# EAGLE design 40106PolyClock (EAGLE 8.7.0)
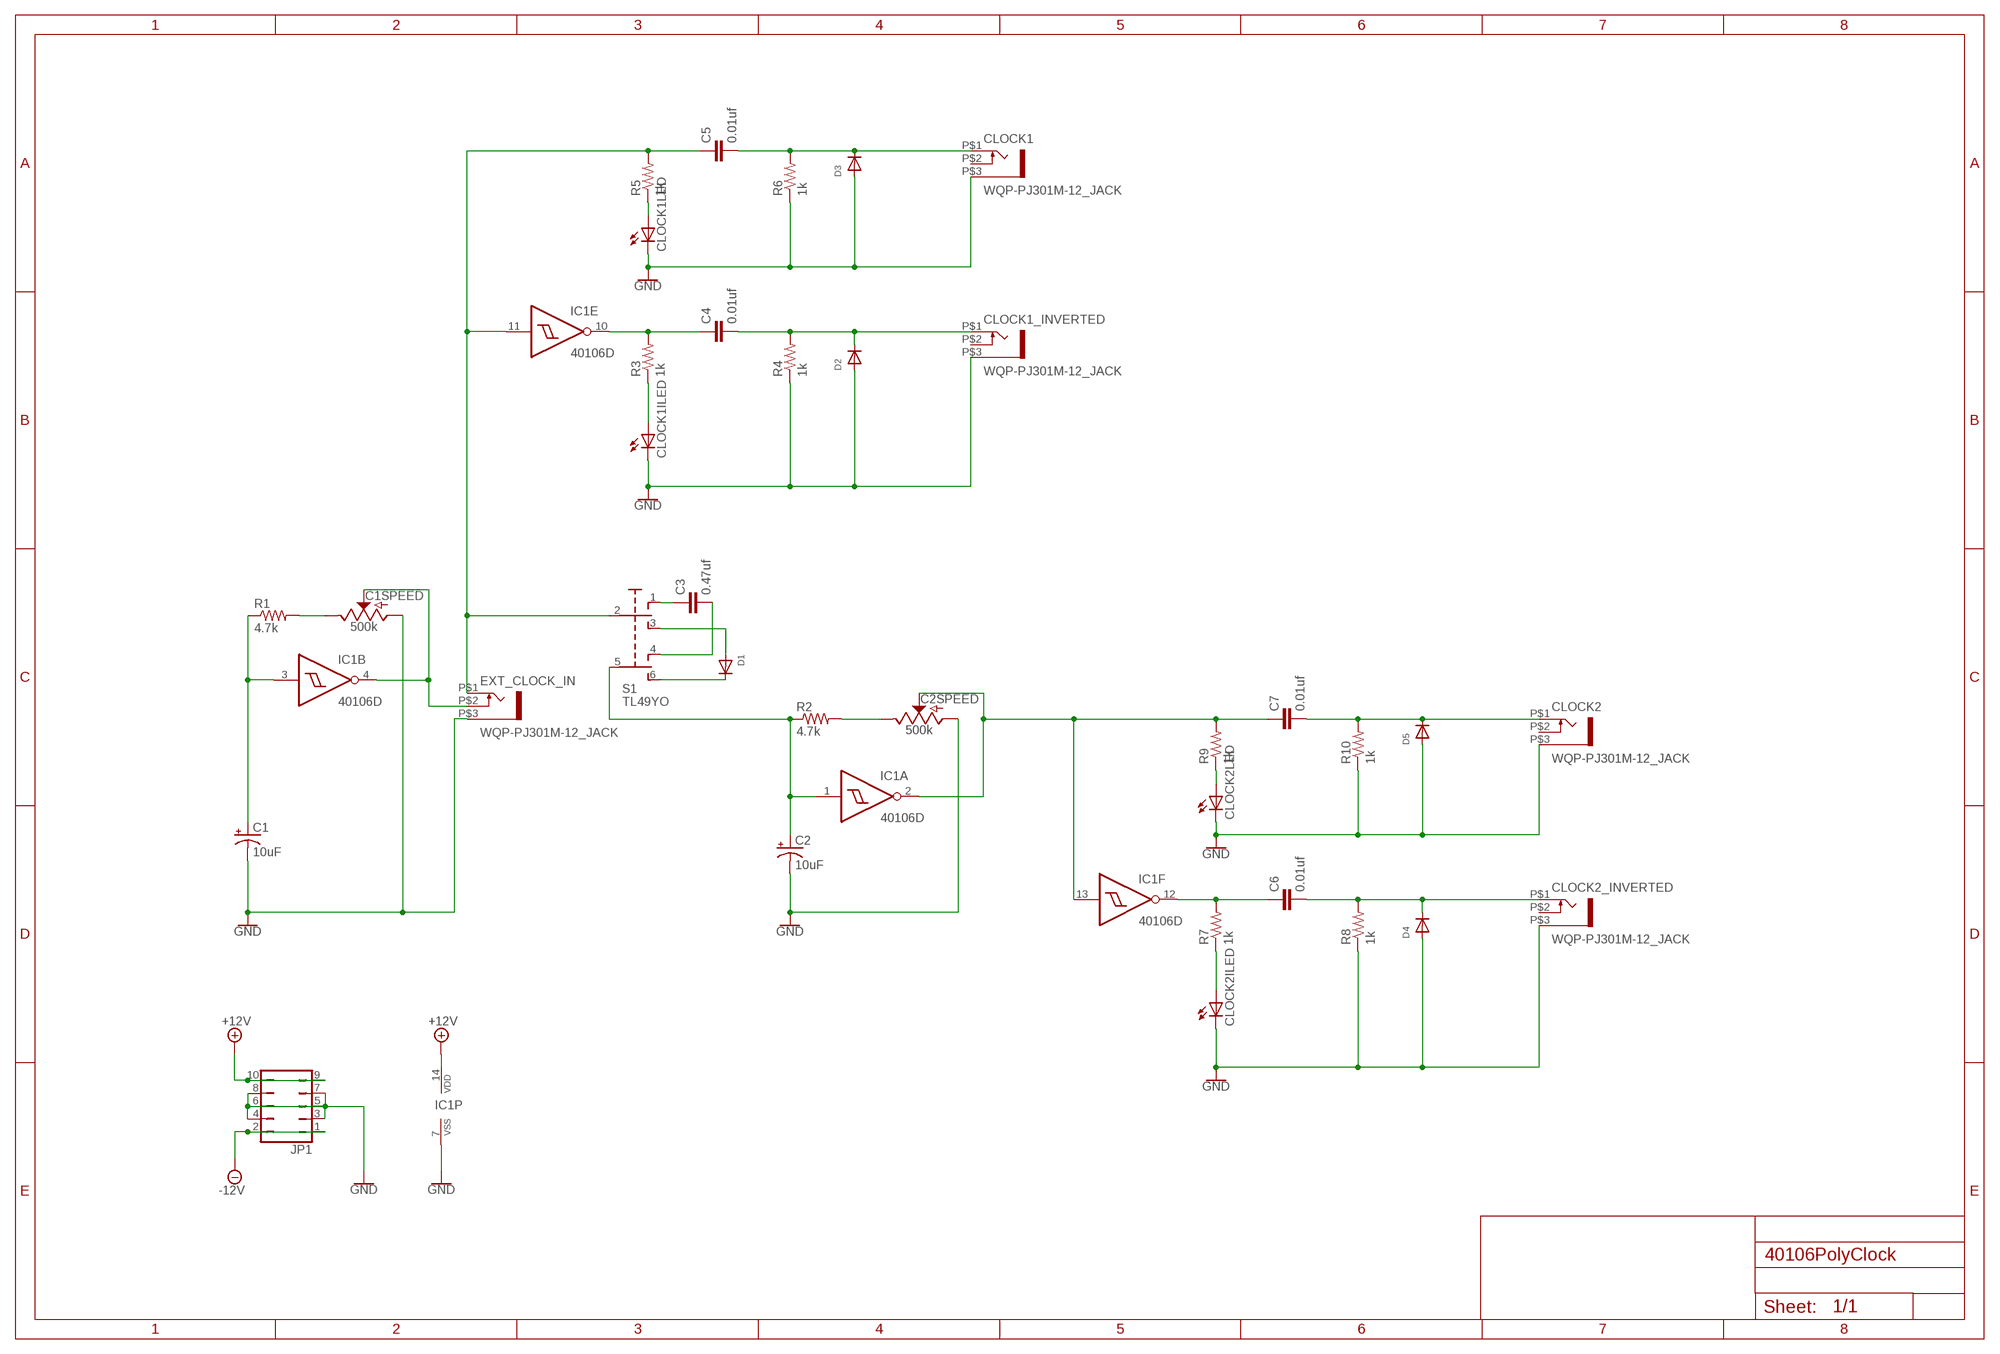
[diagram p0: schematic, sheet 1]

## Parts
C1  10uF  10UF-POLAR-0603-6.3V-20%(TANT)  [0603-POLAR]
C1SPEED  500k  POTENTIOMETER-PTH-9MM-1/20W-20%-KIT  [POT-PTH-ALPS-KIT]
C2  10uF  10UF-POLAR-0603-6.3V-20%(TANT)  [0603-POLAR]
C2SPEED  500k  POTENTIOMETER-PTH-9MM-1/20W-20%-KIT  [POT-PTH-ALPS-KIT]
C3  0.47uf  C-EUC1206  [C1206]
C4  0.01uf  C-EUC1206  [C1206]
C5  0.01uf  C-EUC1206  [C1206]
C6  0.01uf  C-EUC1206  [C1206]
C7  0.01uf  C-EUC1206  [C1206]
CLOCK1  WQP-PJ301M-12_JACK  [WQP-PJ301M-12_JACK]
CLOCK1_INVERTED  WQP-PJ301M-12_JACK  [WQP-PJ301M-12_JACK]
CLOCK1ILED  LED5MM  [LED5MM]
CLOCK1LED  LED5MM  [LED5MM]
CLOCK2  WQP-PJ301M-12_JACK  [WQP-PJ301M-12_JACK]
CLOCK2_INVERTED  WQP-PJ301M-12_JACK  [WQP-PJ301M-12_JACK]
CLOCK2ILED  LED5MM  [LED5MM]
CLOCK2LED  LED5MM  [LED5MM]
D1  DIODESOD-123  [SOD-123]
D2  DIODESOD-123  [SOD-123]
D3  DIODESOD-123  [SOD-123]
D4  DIODESOD-123  [SOD-123]
D5  DIODESOD-123  [SOD-123]
EXT_CLOCK_IN  WQP-PJ301M-12_JACK  [WQP-PJ301M-12_JACK]
IC1  40106D  [SO14]
JP1  JP5Q  [JP5Q]
R1  4.7k  R-US_R1206  [R1206]
R2  4.7k  R-US_R1206  [R1206]
R3  1k  R-US_R1206  [R1206]
R4  1k  R-US_R1206  [R1206]
R5  1k  R-US_R1206  [R1206]
R6  1k  R-US_R1206  [R1206]
R7  1k  R-US_R1206  [R1206]
R8  1k  R-US_R1206  [R1206]
R9  1k  R-US_R1206  [R1206]
R10  1k  R-US_R1206  [R1206]
S1  TL49YO  [TL4XYO]

## Nets
+12V: IC1.14(P:VDD) JP1.9 JP1.10
-12V: JP1.1 JP1.2
GND: C1.- C1SPEED.P$3(A) C2.- C2SPEED.P$3(A) CLOCK1.P$3 CLOCK1_INVERTED.P$3 CLOCK1ILED.K(C) CLOCK1LED.K(C) CLOCK2.P$3 CLOCK2_INVERTED.P$3 CLOCK2ILED.K(C) CLOCK2LED.K(C) D2.A D3.A D4.A D5.A EXT_CLOCK_IN.P$3 IC1.7(P:VSS) JP1.3 JP1.4 JP1.5 JP1.6 JP1.7 JP1.8 R4.1 R6.1 R8.1 R10.1
N$1: C1.+ IC1.3(B:I) R1.1
N$2: C1SPEED.P$1(E) R1.2
N$3: C1SPEED.P$2(S) EXT_CLOCK_IN.P$2 IC1.4(B:O)
N$4: C5.1 EXT_CLOCK_IN.P$1 IC1.11(E:I) R5.2 S1.2(P)
N$5: C3.1 S1.1(O)
N$6: C3.2 S1.4(O1)
N$7: D1.A S1.3(S)
N$8: D1.C S1.6(S1)
N$9: C2.+ IC1.1(A:I) R2.1 S1.5(P1)
N$10: C2SPEED.P$1(E) R2.2
N$12: C6.1 IC1.12(F:O) R7.2
N$13: CLOCK2ILED.A R7.1
N$14: C6.2 CLOCK2_INVERTED.P$1 D4.C R8.2
N$15: C7.2 CLOCK2.P$1 D5.C R10.2
N$16: C4.1 IC1.10(E:O) R3.2
N$17: CLOCK1ILED.A R3.1
N$18: C4.2 CLOCK1_INVERTED.P$1 D2.C R4.2
N$19: CLOCK1LED.A R5.1
N$20: C5.2 CLOCK1.P$1 D3.C R6.2
N$21: C2SPEED.P$2(S) C7.1 IC1.2(A:O) IC1.13(F:I) R9.2
N$23: CLOCK2LED.A R9.1
Unconnected: CLOCK1.P$2 CLOCK1_INVERTED.P$2 CLOCK2.P$2 CLOCK2_INVERTED.P$2 IC1.5(C:I) IC1.6(C:O) IC1.8(D:O) IC1.9(D:I)

## Library data of the parts
C1 C2 = SparkFun-Capacitors:10UF-POLAR: 10.0µF polarized capacitors A capacitor is a passive two-terminal electrical component used to store electrical energy temporarily in an electric field.; PROD_ID: CAP-13210
C1SPEED C2SPEED = SparkFun-Resistors:POTENTIOMETER: Potentiometer (Pot) Three-terminal potentiometers, with an adjustable wiper and two adjustable resistors. A pot can be used to create a configurable voltage divider, or as a variable resistor. Variants ALPS_POT and ALPS_POT_KIT - PTH, breadboard compatible, 9mm square pots Rotary Potentiometer - Linear (10k ohm) <https://www.sparkfun.com/products/9288> (COM-09288) The KIT variant exposes copper on only one side of the PTH pad, so the part can only be assembled on one side of the PCB. Useful for beginner soldering kits.; PROD_ID: RES-09177; SF_SKU: COM-09288; VALUE: 10k
C3-C7 = resistor:C-EU: CAPACITOR, European symbol
CLOCK1 CLOCK1_INVERTED CLOCK2 CLOCK2_INVERTED EXT_CLOCK_IN = thonkiconn:WQP-PJ301M-12_JACK
CLOCK1ILED CLOCK1LED CLOCK2ILED CLOCK2LED = adafruit:LED: LED OSRAM: - CHIPLED LG R971, LG N971, LY N971, LG Q971, LY Q971, LO R971, LY R971 LH N974, LH R974 LS Q976, LO Q976, LY Q976 LO Q996 - Hyper CHIPLED LW Q18S LB Q993, LB Q99A, LB R99A - SideLED LS A670, LO A670, LY A670, LG A670, LP A670 LB A673, LV A673, LT A673, LW A673 LH A674 LY A675 LS A676, LA A676, LO A676, LY A676, LW A676 LS A679, LY A679, LG A679 - Hyper Micro SIDELED® LS Y876, LA Y876, LO Y876, LY Y876 LT Y87S - SmartLED LW L88C, LW L88S LB L89C, LB L89S, LG L890 LS L89K, LO L89K, LY L89K LS L896, LA L896, LO L896, LY L896 - TOPLED LS T670, LO T670, LY T670, LG T670, LP T670 LSG T670, LSP T670, LSY T670, LOP T670, LYG T670 LG T671, LOG T671, LSG T671 LB T673, LV T673, LT T673, LW T673 LH T674 LS T676, LA T676, LO T676, LY T676, LB T676, LH T676, LSB T676, LW T676 LB T67C, LV T67C, LT T67C, LS T67K, LO T67K, LY T67K, LW E67C LS E67B, LA E67B, LO E67B, LY E67B, LB E67C, LV E67C, LT E67C LW T67C LS T679, LY T679, LG T679 LS T770, LO T770, LY T770, LG T770, LP T770 LB T773, LV T773, LT T773, LW T773 LH T774 LS E675, LA E675, LY E675, LS T675 LS T776, LA T776, LO T776, LY T776, LB T776 LHGB T686 LT T68C, LB T68C - Hyper Mini TOPLED® LB M676 - Mini TOPLED Santana® LG M470 LS M47K, LO M47K, LY M47K Source: http://www.osram.convergy.de/
D1-D5 = adafruit:DIODE: Diode SMADIODE - SMA Surface Mount Package 20V 1A Schottky Diode Digikey: 641-1014-6-ND DO-1N4148 - Through Hole Small Current Diode SOD-123 20V 1 A (.5mV Vf) Schottky Diode - Digikey: MBRX120TPMSCT-ND SOD-323 10V 570mA (.38mV Vf, 3ns) Schottky Diode - Digikey: ZLLS410CT-ND SOD-523 30V 30mA Schottky Diode (RB751S-40TE61) - Digikey: RB751S-40TE61CT-ND SOT23-R/W - SOT23 Package (R = Solder Paste/Reflow Ovens, W = Hand-Soldering) BAT54Film 40V 300mA - Digikey: 497-7162-1-ND
IC1 = 40xx:40106: Hex SCHMITT TRIGGER
JP1 = jumper:JP5Q: JUMPER
R1-R10 = adafruit:R-US_: RESISTOR, American symbol
S1 = switch:TL49YO: TINY SWITCH ON OFF ON Source: http://www2.produktinfo.conrad.com/datenblaetter/700000-724999/705152-da-01-de-Subminiaturschalter_TL_36YO.pdf

## Board
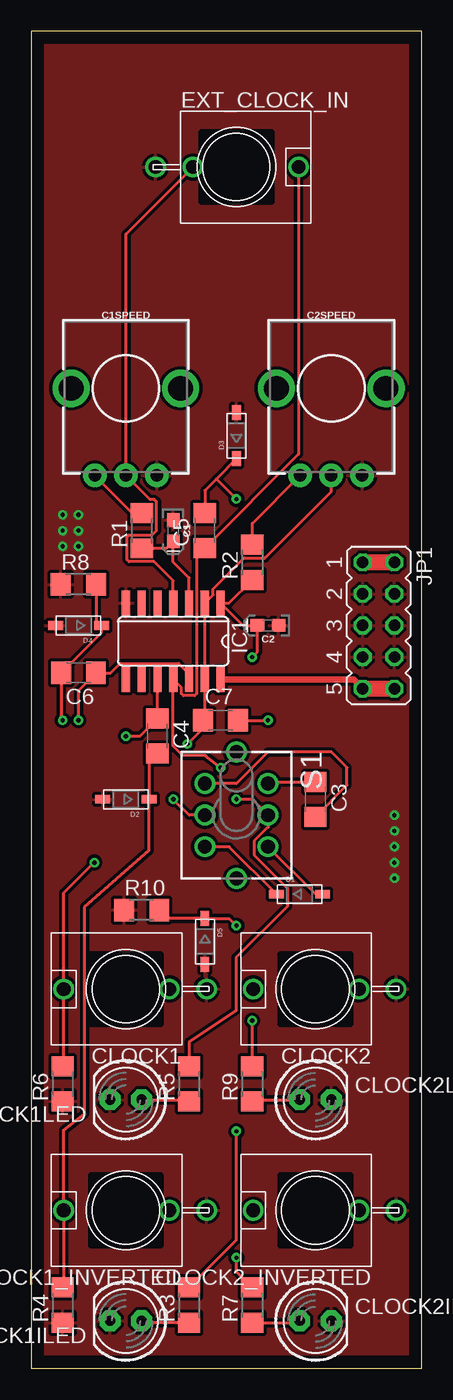
[diagram p1: board, top side]
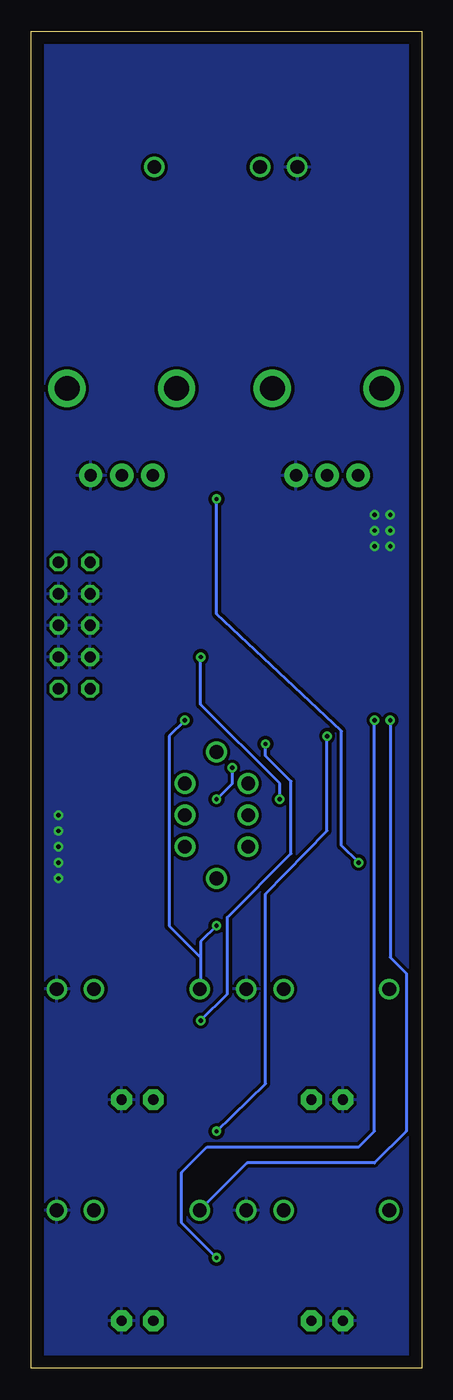
[diagram p2: board, bottom side, seen from below]

Size 31.42 x 107.44 mm. Coordinates in mm from the lower left corner, seen from the top.
Outline: 0,0 31.42,0 31.42,107.44 0,107.44 0,0
Copper layers (1*16): Top 0.035mm / dielectric 1.5mm / Bottom 0.035mm
Design rules "default": minimum track width 6mil, minimum drill 0.35mm, track to track 6mil, track to pad 6mil, pad to pad 6mil, via to via 6mil, smd to smd 6mil, copper to edge 40mil, drill to drill 6mil, minimum pad ring 10mil, minimum via ring 8mil, stop-mask expansion 4mil, vias tented up to drill 0mil, thermal gap 10mil

### Footprints (pad centres in the part's own frame; a part is rotated, then mirrored left to right if it is on the bottom)
0603-POLAR = smd 1.1 x 1: + 0.85,0; - -0.85,0
POT-PTH-ALPS-KIT = drill 1 pad 1.88: P$1 7,-2.5; P$2 7,0; P$3 7,2.5 | drill 2: P$4 0,-4.4; P$5 0,4.4
C1206 = smd 1.6 x 1.8: 1 -1.4,0; 2 1.4,0
WQP-PJ301M-12_JACK = drill 1.1: P$1 0,5; P$2 0,-3.5; P$3 0,-6.5
LED5MM = drill 0.813 pad 1.676 octagon: A -1.27,0; K 1.27,0
SOD-123 = smd 1.2 x 0.7: A 1.85,0; C -1.85,0
SO14 = smd 0.66 x 2.032: 1 -3.81,-3.073; 2 -2.54,-3.073; 3 -1.27,-3.073; 4 0,-3.073; 5 1.27,-3.073; 6 2.54,-3.073; 7 3.81,-3.073; 8 3.81,3.073; 9 2.54,3.073; 10 1.27,3.073; 11 0,3.073; 12 -1.27,3.073; 13 -2.54,3.073; 14 -3.81,3.073
JP5Q = drill 0.914 octagon: 1 -5.08,-1.27; 2 -5.08,1.27; 3 -2.54,-1.27; 4 -2.54,1.27; 5 0,-1.27; 6 0,1.27; 7 2.54,-1.27; 8 2.54,1.27; 9 5.08,-1.27; 10 5.08,1.27
R1206 = smd 1.6 x 1.803: 1 -1.422,0; 2 1.422,0
TL4XYO = drill 1.1 pad 1.676: 1 -2.54,2.54; 2 0,2.54; 3 2.54,2.54; 4 -2.54,-2.54; 5 0,-2.54; 6 2.54,-2.54; M1 -5.08,0; M2 5.08,0

### Placement (x,y rotation side)
C1  11.43,67.31 270 top
C1SPEED  7.62,78.74 270 top
C2  19.05,59.69 180 top
C2SPEED  24.13,78.74 270 top
C3  22.86,45.72 270 top
C4  10.16,50.8 270 top
C5  13.97,67.31 90 top
C6  3.81,55.88 180 top
C7  15.24,52.07 0 top
CLOCK1  7.62,30.48 90 top
CLOCK1_INVERTED  7.62,12.7 90 top
CLOCK1ILED  7.62,3.81 180 top
CLOCK1LED  7.62,21.59 180 top
CLOCK2  22.86,30.48 90 top
CLOCK2_INVERTED  22.86,12.7 90 top
CLOCK2ILED  22.86,3.81 0 top
CLOCK2LED  22.86,21.59 0 top
D1  21.59,38.1 0 top
D2  7.62,45.72 180 top
D3  16.51,74.93 90 top
D4  3.81,59.69 180 top
D5  13.97,34.29 270 top
EXT_CLOCK_IN  16.51,96.52 270 top
IC1  11.43,58.42 180 top
JP1  27.94,59.69 270 top
R1  8.89,67.31 90 top
R2  17.78,64.77 90 top
R3  12.7,5.08 90 top
R4  2.54,5.08 90 top
R5  12.7,22.86 90 top
R6  2.54,22.86 90 top
R7  17.78,5.08 90 top
R8  3.81,62.99 0 top
R9  17.78,22.86 90 top
R10  8.89,36.83 0 top
S1  16.51,44.45 270 top

### Tracks (layer width: path | path; a pad name or v marks a point on that pad's centre or on a via)
+12V
  Top 0.508: JP1.9 25.93,55.35 IC1.14
  Top 1.27: JP1.9 JP1.10
-12V
  Top 1.27: JP1.1 JP1.2
GND  (via drill 0.35)
  other vias: 29.21,44.45 29.21,43.18 29.21,41.91 29.21,40.64 29.21,39.37 2.54,68.58 3.81,68.58 3.81,67.31 2.54,67.31 2.54,66.04 3.81,66.04
  pour Bottom (isolate 0.254): 0,107.95 0,0 31.75,0 31.75,107.95
  pour Top (isolate 0.254): 0,107.95 0,0 31.75,0 31.75,107.95
N$1
  Top 0.254: IC1.3 12.7,63.5 11.43,64.77 C1.+ 10.86,65.89 R1.1
N$2
  Top 0.254: R1.2 8.13,68.73 C1SPEED.P$1
N$3
  Top 0.254: IC1.4 11.43,63.29 9.91,64.81 7.87,64.81 7.71,64.97 7.71,66.8 7.87,66.97 9.72,66.97 10.07,67.31 10.07,69.65 9.91,69.81 9.55,69.81 C1SPEED.P$2 7.62,91.13 EXT_CLOCK_IN.P$2
N$4  (via drill 0.35)
  Top 0.254: EXT_CLOCK_IN.P$1 21.51,73.45 C5.1 13.31,65.25 13.31,54.22 13.15,54.05 12.25,54.05 12.09,54.22 12.09,54.69 IC1.11 11.43,50 12.17,49.25 13.99,49.25 v15.24,48.26 | R5.2 12.7,26.23 16.49,28.75 16.49,33 20.62,37.13 20.62,38.57 17.93,41.25 17.93,42.37 19.05,43.49 S1.2 17.78,45.72 v16.51,45.72
  Bottom 0.254: v16.51,45.72 15.24,46.99 v15.24,48.26
N$5
  Top 0.254: S1.1 19.18,47.12 C3.1
N$6
  Top 0.254: C3.2 25.4,46.86 25.4,48.26 24.13,49.53 19.05,49.53 16.51,46.99 S1.4
N$7
  Top 0.254: S1.3 22.86,38.1 D1.A
N$8
  Top 0.254: D1.C 15.93,41.91 S1.6
N$9  (via drill 0.35)
  Top 0.254: R2.1 15.93,61.49 IC1.1 17.04,59.69 C2.+ 18.2,57.57 v17.78,57.15 | S1.5 12.7,44.45 v11.43,45.72
  Bottom 0.254: v11.43,45.72 11.43,46.99 17.78,53.34 v17.78,57.15
N$10
  Top 0.254: R2.2 17.78,67.89 C2SPEED.P$1
N$12  (via drill 0.35)
  Top 0.254: IC1.12 12.7,55.88 12.64,55.88 11.88,56.64 7.17,56.64 6.41,55.88 C6.1 3.81,54.48 v3.81,52.07 | R7.2 16.51,7.77 v16.51,8.89
  Bottom 0.254: v16.51,8.89 19.3,11.68 19.3,15.75 17.27,17.78 5.08,17.78 3.81,19.05 v3.81,52.07
N$13
  Top 0.254: R7.1 21.44,3.66 CLOCK2ILED.A
N$14  (via drill 0.35)
  Top 0.254: R8.2 5.23,60.12 D4.C 5.66,59.13 C6.2 2.41,52.2 v2.54,52.07
  Bottom 0.254: v2.54,52.07 2.54,33.02 1.27,31.75 1.27,19.05 3.81,16.51 14.05,16.51 CLOCK2_INVERTED.P$1
N$15  (via drill 0.35)
  Top 0.254: R10.2 11,36.14 D5.C 15.93,36.14 v16.51,35.56 | C7.2 v19.05,52.07
  Bottom 0.254: v19.05,52.07 20.32,50.8 20.32,35.56 17.78,33.02 | 17.78,33.02 17.78,30.56 CLOCK2.P$1 | v16.51,35.56 17.78,34.29 17.78,33.02
N$16  (via drill 0.35)
  Top 0.254: IC1.10 C4.1 8.76,50.8 v7.62,50.8 | R3.2 16.51,10.31 v16.51,19.05
  Bottom 0.254: v16.51,19.05 12.57,22.86 12.57,38.1 7.62,43.18 v7.62,50.8
N$17
  Top 0.254: R3.1 9.04,3.66 CLOCK1ILED.A
N$18
  Top 0.254: C4.2 9.47,48.71 D2.C 9.47,41.6 4.32,37.08 4.32,20.45 2.62,19.13 CLOCK1_INVERTED.P$1 2.62,6.58 R4.2
N$19
  Top 0.254: CLOCK1LED.A 12.55,21.59 R5.1
N$20  (via drill 0.35)
  Top 0.254: D3.C 14.89,71.47 | 14.89,71.47 13.97,70.54 C5.2 | R6.2 2.62,24.36 CLOCK1.P$1 2.62,38.18 v5.08,40.64 | v16.51,69.85 14.89,71.47
  Bottom 0.254: v5.08,40.64 6.45,42.01 6.45,51.2 16.51,60.62 v16.51,69.85
N$21  (via drill 0.35)
  Top 0.254: C2SPEED.P$2 24.13,70.44 18.8,65.11 17.12,65.11 14.63,62.62 14.63,62.15 IC1.2 IC1.13 13.97,52.2 C7.1 13.84,51.43 v12.57,50.16 | R9.2 v17.78,27.94
  Bottom 0.254: v17.78,27.94 15.65,30.07 15.65,36.24 10.52,41.36 10.52,47.16 12.57,49.22 v12.57,50.16
N$23
  Top 0.254: R9.1 17.93,21.59 CLOCK2LED.A